# EAGLE design potentiometer_breakout (EAGLE 9.6.0)
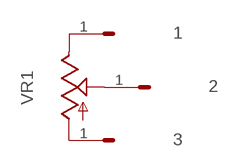
[diagram p0: schematic, sheet 1]

## Parts
1  HEADER/MALE/01  [HEADER/MALE/01]
2  HEADER/MALE/01  [HEADER/MALE/01]
3  HEADER/MALE/01  [HEADER/MALE/01]
VR1  9MM_SNAP-IN_POT_  [9MM_SNAP-IN_POT]

## Nets
N$1: 1.1 VR1.3(E)
N$2: 2.1 VR1.2(S)
N$3: 3.1 VR1.1(A)

## Library data of the parts
1-3 = connectors:HEADER/MALE/01
VR1 = controls:9MM_SNAP-IN_POT: 9mm vertical snap-in pot, Alpha / Panasonic style

## Board
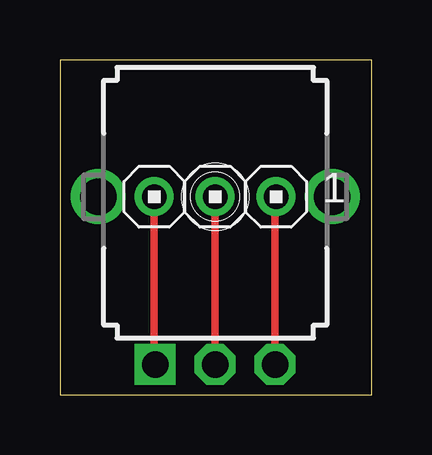
[diagram p1: board, top side]

Size 13.01 x 13.96 mm. Coordinates in mm from the lower left corner, seen from the top.
Outline: 0,0 13.01,0 13.01,13.96 0,13.96 0,0
Copper layers (1*16): Top 0.0356mm / dielectric 1.5011mm / Bottom 0.0356mm
Design rules "pigatron": minimum track width 12mil, minimum drill 13mil, track to track 15mil, track to pad 10mil, pad to pad 10mil, via to via 10mil, smd to smd 6mil, copper to edge 15mil, drill to drill 10mil, minimum pad ring 12mil, minimum via ring 10mil, stop-mask expansion 4mil, vias tented up to drill 0mil, thermal gap 10mil

### Footprints (pad centres in the part's own frame; a part is rotated, then mirrored left to right if it is on the bottom)
HEADER/MALE/01 = drill 1.016: 1 0,0
9MM_SNAP-IN_POT = drill 1.1 square: 1 -2.5,-7 | drill 1.1 octagon: 2 0,-7; 3 2.5,-7 | drill 1.524 pad 2.286: CHASSIS1 -4.881,0; CHASSIS2 4.881,0

### Placement (x,y rotation side)
1  9.02,8.25 0 top
2  6.48,8.25 0 top
3  3.94,8.25 0 top
VR1  6.48,8.25 0 top

### Tracks (layer width: path | path; a pad name or v marks a point on that pad's centre or on a via)
N$1
  Top 0.305: VR1.3 8.98,8.21 1.1
N$2
  Top 0.305: 2.1 VR1.2
N$3
  Top 0.305: VR1.1 3.94,1.29 3.1